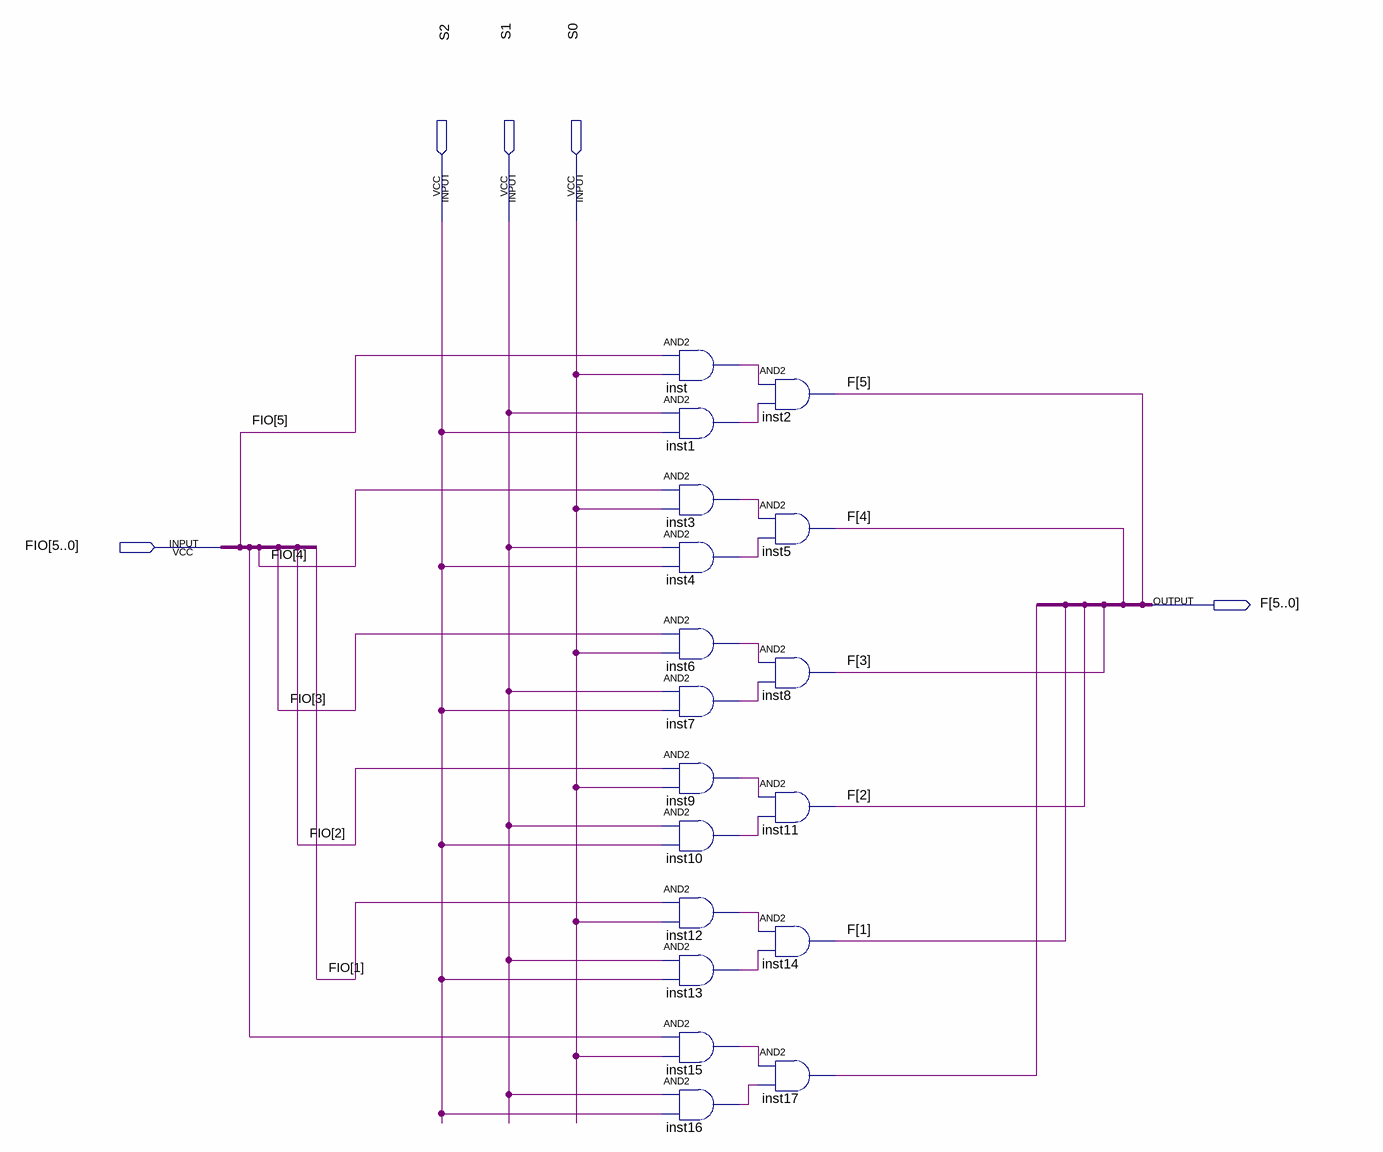
[diagram p0: schematic sheet]
// Quartus schematic MUX_And.bdf as structural Verilog: 18 symbols, 5 pins
module MUX_And (
  input  S2,
  input  S1,
  input  S0,
  input  [5:0] FIO,
  output [5:0] F
);

  wire inst1_out, inst3_out, inst4_out, inst6_out, inst7_out, inst9_out, inst10_out, inst12_out, inst13_out,
       inst15_out, inst16_out, inst17_out, inst_out, undriven;

  and inst (inst_out, FIO[5], S0);
  and inst1 (inst1_out, S1, S2);
  and inst3 (inst3_out, FIO[4], S0);
  and inst4 (inst4_out, S1, S2);
  and inst6 (inst6_out, FIO[3], S0);
  and inst7 (inst7_out, S1, S2);
  and inst9 (inst9_out, FIO[2], S0);
  and inst10 (inst10_out, S1, S2);
  and inst12 (inst12_out, FIO[1], S0);
  and inst13 (inst13_out, S1, S2);
  and inst15 (inst15_out, undriven, S0);
  and inst16 (inst16_out, S1, S2);
  and inst2 (F[5], inst_out, inst1_out);
  and inst5 (F[4], inst3_out, inst4_out);
  and inst8 (F[3], inst6_out, inst7_out);
  and inst11 (F[2], inst9_out, inst10_out);
  and inst14 (F[1], inst12_out, inst13_out);
  and inst17 (inst17_out, inst15_out, inst16_out);
endmodule
